# EAGLE design Power PCB_v4 (EAGLE 9.7.0)
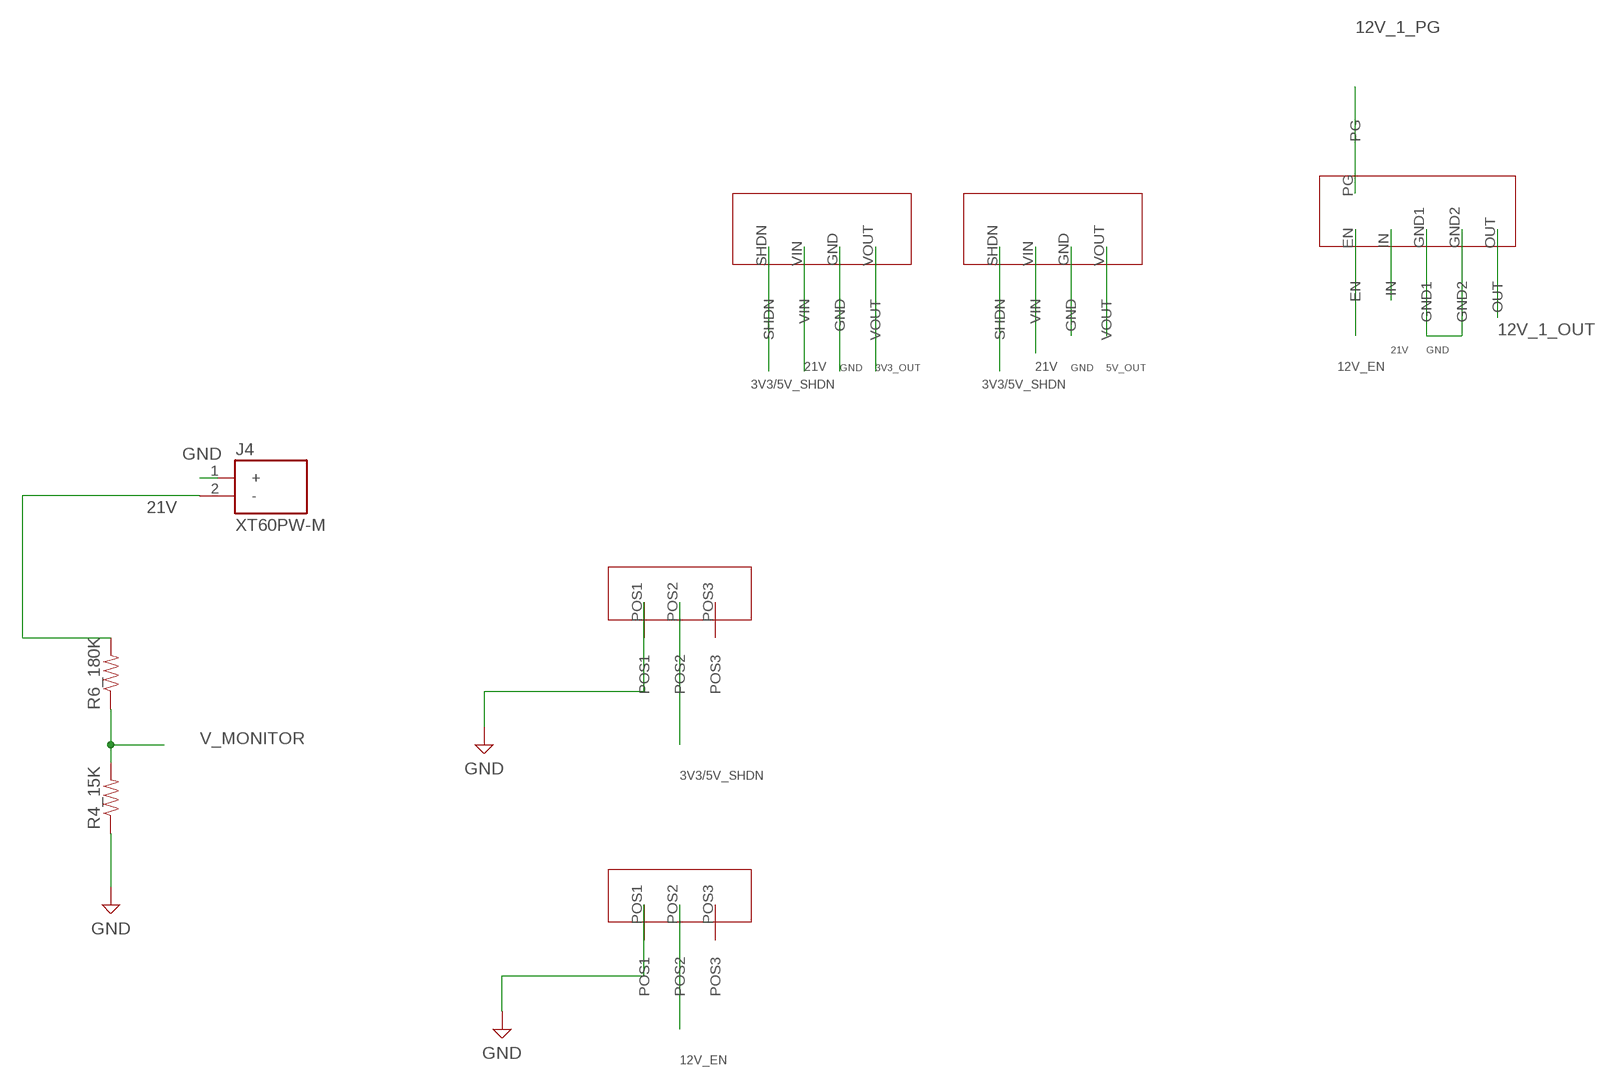
[diagram p0: schematic, sheet 1, part 1 of 2]
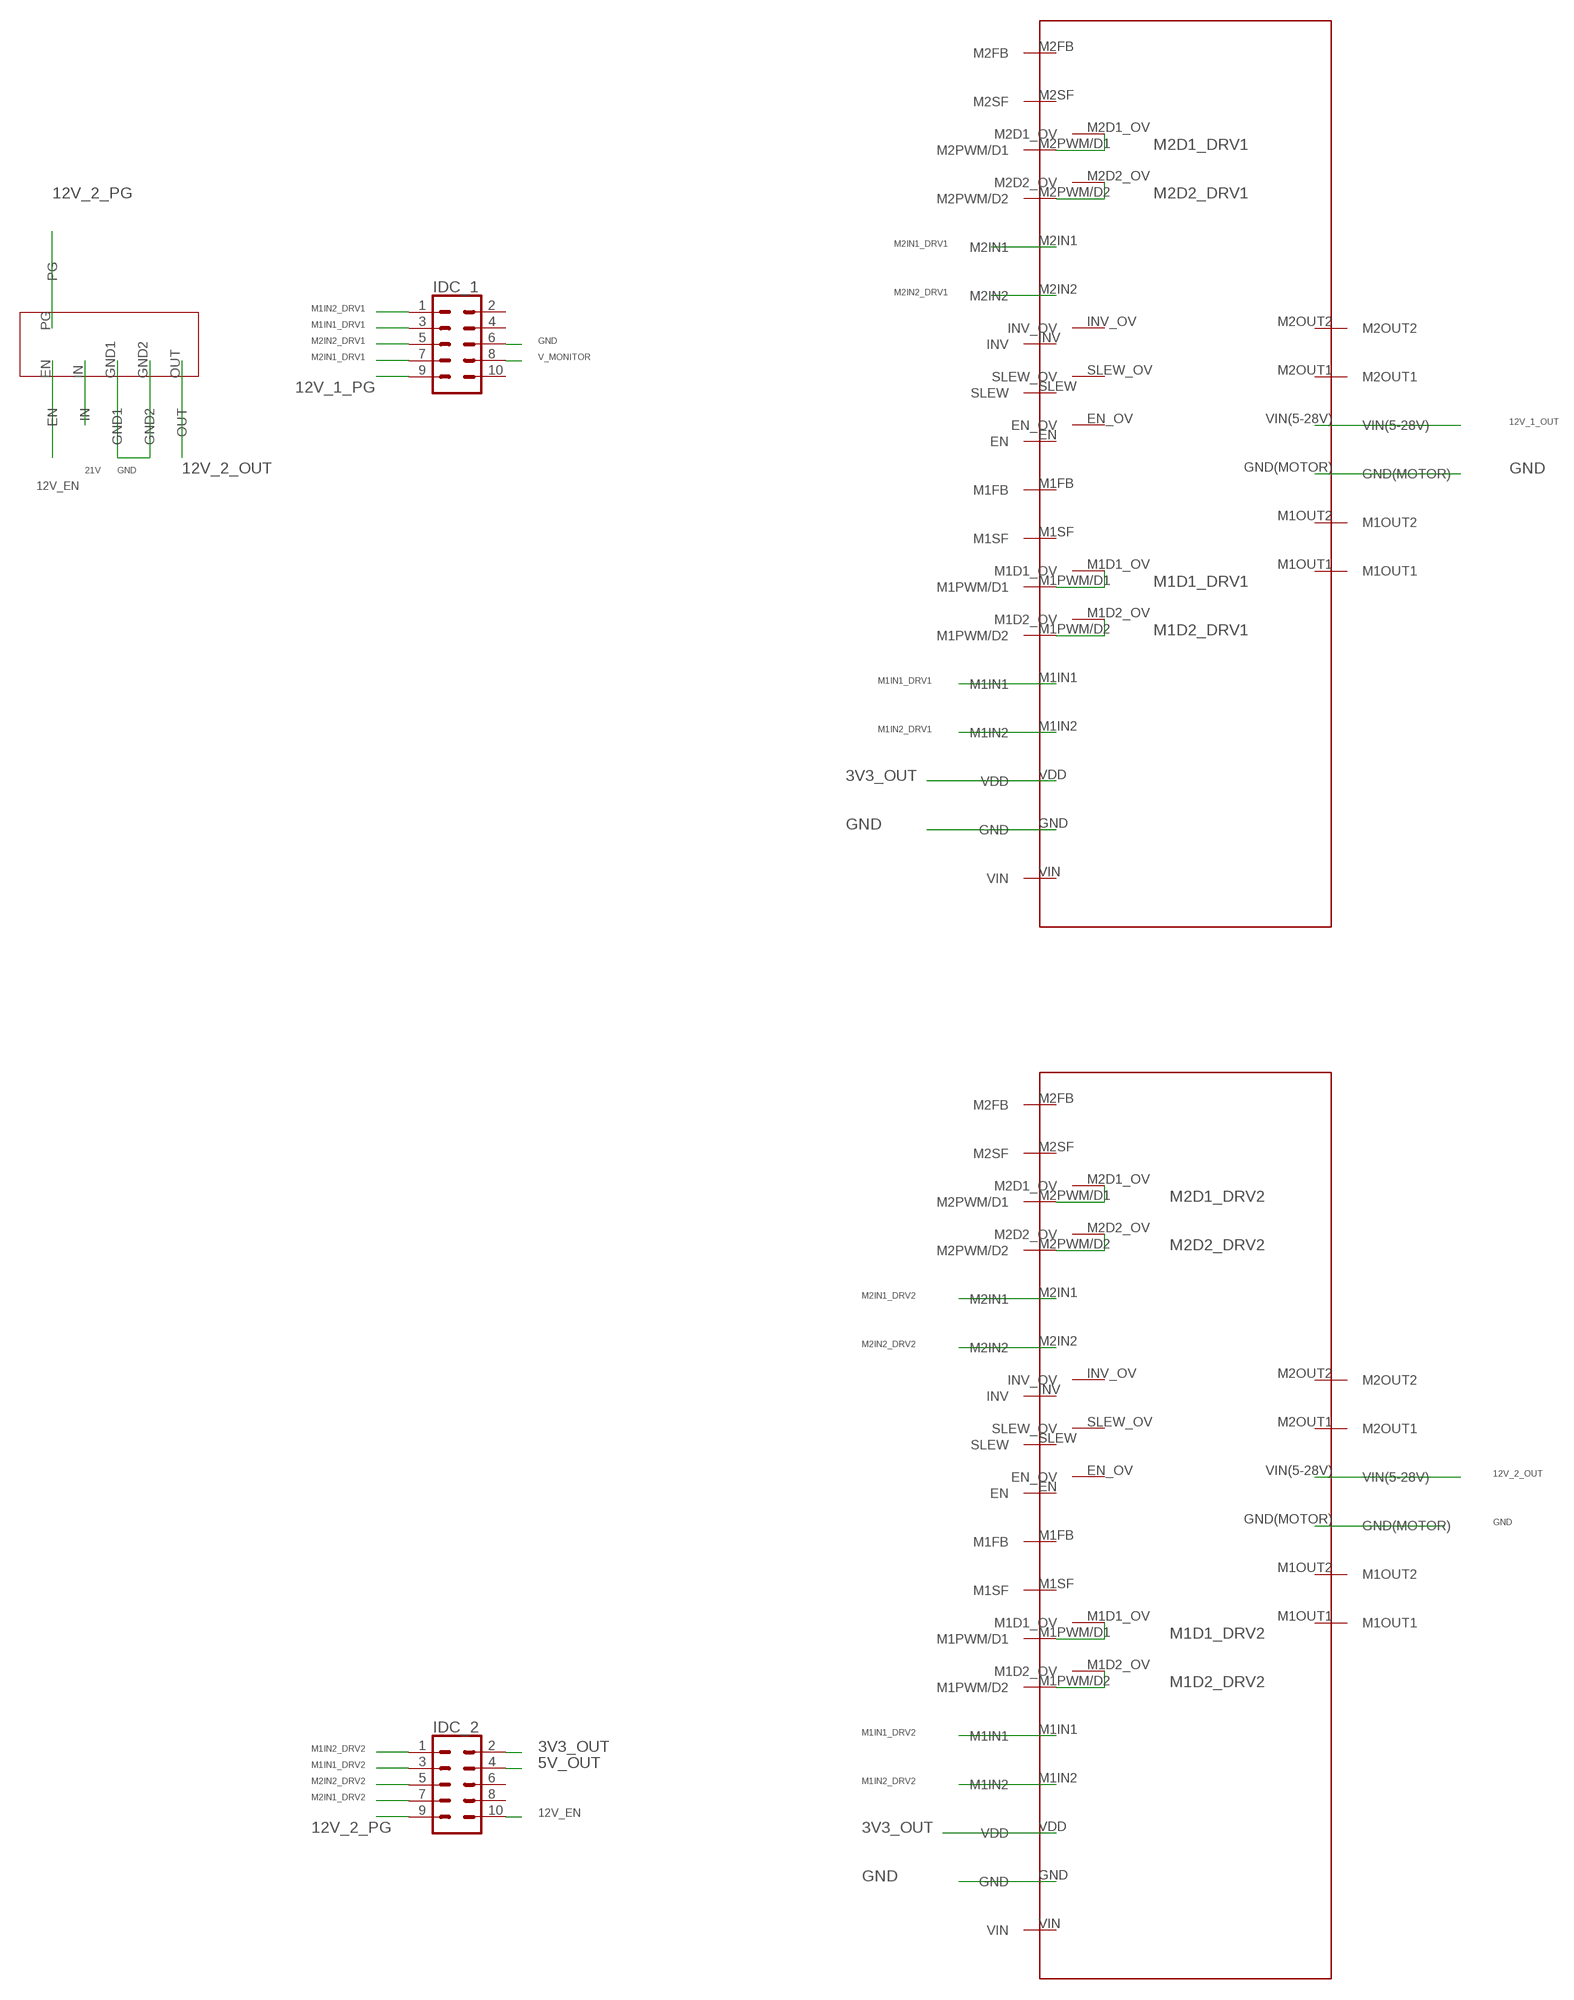
[diagram p1: schematic, sheet 1, part 2 of 2]

## Parts
IDC_1  CONN_05X2PTH  [2X5]
IDC_2  CONN_05X2PTH  [2X5]
J4  XT60PW-M  [AMASS_XT60PW-M]
R4_15K  RESISTORAXIAL-0.3  [AXIAL-0.3]
R6_180K  RESISTORAXIAL-0.3  [AXIAL-0.3]
U$1  CUSTOM_MOTORDRIVER  [CUSTOM_MOTORDRIVER]
U$2  CUSTOM_12V_REG  [CUSTOM_12V_REG]
U$3  CUSTOM_12V_REG  [CUSTOM_12V_REG]
U$4  CUSTOM_3.3/5V_REG  [CUSTOM_3.3/5V_REG]
U$5  CUSTOM_3.3/5V_REG  [CUSTOM_3.3/5V_REG]
U$6  CUSTOM_MOTORDRIVER  [CUSTOM_MOTORDRIVER]
U$7  CUSTOM_SWITCH  [CUSTOM_SWITCH]
U$8  CUSTOM_SWITCH  [CUSTOM_SWITCH]

## Nets
3V3/5V_SHDN: U$4.SHDN U$5.SHDN U$7.POS2
3V3_OUT: IDC_2.2 U$1.VDD U$4.VOUT U$6.VDD
5V_OUT: IDC_2.4 U$5.VOUT
12V_1_OUT: U$1.VIN(5-28V) U$3.OUT
12V_1_PG: IDC_1.9 U$3.PG
12V_2_OUT: U$2.OUT U$6.VIN(5-28V)
12V_2_PG: IDC_2.9 U$2.PG
12V_EN: IDC_2.10 U$2.EN U$3.EN U$8.POS2
21V: J4.2(-) R6_180K.P$2 U$2.IN U$3.IN U$4.VIN U$5.VIN
GND: IDC_1.6 J4.1(+) R4_15K.P$1 U$1.GND U$1.GND(MOTOR) U$2.GND1 U$2.GND2 U$3.GND1 U$3.GND2 U$4.GND U$5.GND U$6.GND U$6.GND(MOTOR) U$7.POS1 U$8.POS1
M1D1_DRV1: U$1.M1D1_OV U$1.M1PWM/D1
M1D1_DRV2: U$6.M1D1_OV U$6.M1PWM/D1
M1D2_DRV1: U$1.M1D2_OV U$1.M1PWM/D2
M1D2_DRV2: U$6.M1D2_OV U$6.M1PWM/D2
M1IN1_DRV1: IDC_1.3 U$1.M1IN1
M1IN1_DRV2: IDC_2.3 U$6.M1IN1
M1IN2_DRV1: IDC_1.1 U$1.M1IN2
M1IN2_DRV2: IDC_2.1 U$6.M1IN2
M2D1_DRV1: U$1.M2D1_OV U$1.M2PWM/D1
M2D1_DRV2: U$6.M2D1_OV U$6.M2PWM/D1
M2D2_DRV1: U$1.M2D2_OV U$1.M2PWM/D2
M2D2_DRV2: U$6.M2D2_OV U$6.M2PWM/D2
M2IN1_DRV1: IDC_1.7 U$1.M2IN1
M2IN1_DRV2: IDC_2.7 U$6.M2IN1
M2IN2_DRV1: IDC_1.5 U$1.M2IN2
M2IN2_DRV2: IDC_2.5 U$6.M2IN2
V_MONITOR: IDC_1.8 R4_15K.P$2 R6_180K.P$1
Unconnected: IDC_1.2 IDC_1.4 IDC_1.10 IDC_2.6 IDC_2.8 U$1.EN U$1.EN_OV U$1.INV U$1.INV_OV U$1.M1FB U$1.M1OUT1 U$1.M1OUT2 U$1.M1SF U$1.M2FB U$1.M2OUT1 U$1.M2OUT2 U$1.M2SF U$1.SLEW U$1.SLEW_OV U$1.VIN U$6.EN U$6.EN_OV U$6.INV U$6.INV_OV U$6.M1FB U$6.M1OUT1 U$6.M1OUT2 U$6.M1SF U$6.M2FB U$6.M2OUT1 U$6.M2OUT2 U$6.M2SF U$6.SLEW U$6.SLEW_OV U$6.VIN U$7.POS3 U$8.POS3

## Library data of the parts
IDC_1 IDC_2 = SparkFun-Connectors:CONN_05X2: Multi connection point. Often used as Generic Header-pin footprint for 0.1 inch spaced/style header connections For AVR SPI programming port, see special device with nice symbol: "AVR_SPI_PROG_5x2.dev" You can populate with any combo of single row headers, but if you'd like an exact match, check these: 2x5 AVR ICSP Male Header <https://www.sparkfun.com/products/778> (PRT-00778) 2x5 Pin Shrouded Header <https://www.sparkfun.com/products/8506> (PRT-08506) On any of the 0.1 inch spaced packages, you can populate with these: Break Away Headers - Straight <https://www.sparkfun.com/products/116> (PRT-00116) Break Away Male Headers - Right Angle <https://www.sparkfun.com/products/553> (PRT-00553) Female Headers <https://www.sparkfun.com/products/115> (PRT-00115) Break Away Headers - Machine Pin <https://www.sparkfun.com/products/117> (PRT-00117) Break Away Female Headers - Swiss Machine Pin <https://www.sparkfun.com/products/743> (PRT-00743) Special note: the shrouded connector mates well with our 5x2 ribbon cables: 2x5 Pin IDC Ribbon Cable <https://www.sparkfun.com/products/8535> (PRT-08535); PROD_ID: CONN-08499; SF_ID: PRT-0778
J4 = XT60PW-M:XT60PW-M: Check availability <https://pricing.snapeda.com/parts/XT60PW-M/AMASS/view-part?ref=eda>; AVAILABILITY: Not in stock; CHECK_PRICES: https://www.snapeda.com/parts/XT60PW-M/AMASS/view-part/?ref=eda; DESCRIPTION: Socket, DC supply, male, PIN: 2; MF: AMASS; MP: XT60PW-M; PACKAGE: Package; PRICE: None; SNAPEDA_LINK: https://www.snapeda.com/parts/XT60PW-M/AMASS/view-part/?ref=snap
R4_15K R6_180K = SparkFun-Resistors:RESISTOR: Generic Resistor Package
U$1 U$6 = Custom_MotorDriver:CUSTOM_MOTORDRIVER
U$2 U$3 = Footprint Complete:CUSTOM_12V_REG
U$4 U$5 = Custom_3.3/5V_Reg:CUSTOM_3.3/5V_REG
U$7 U$8 = Custom_Switch:CUSTOM_SWITCH

## Board
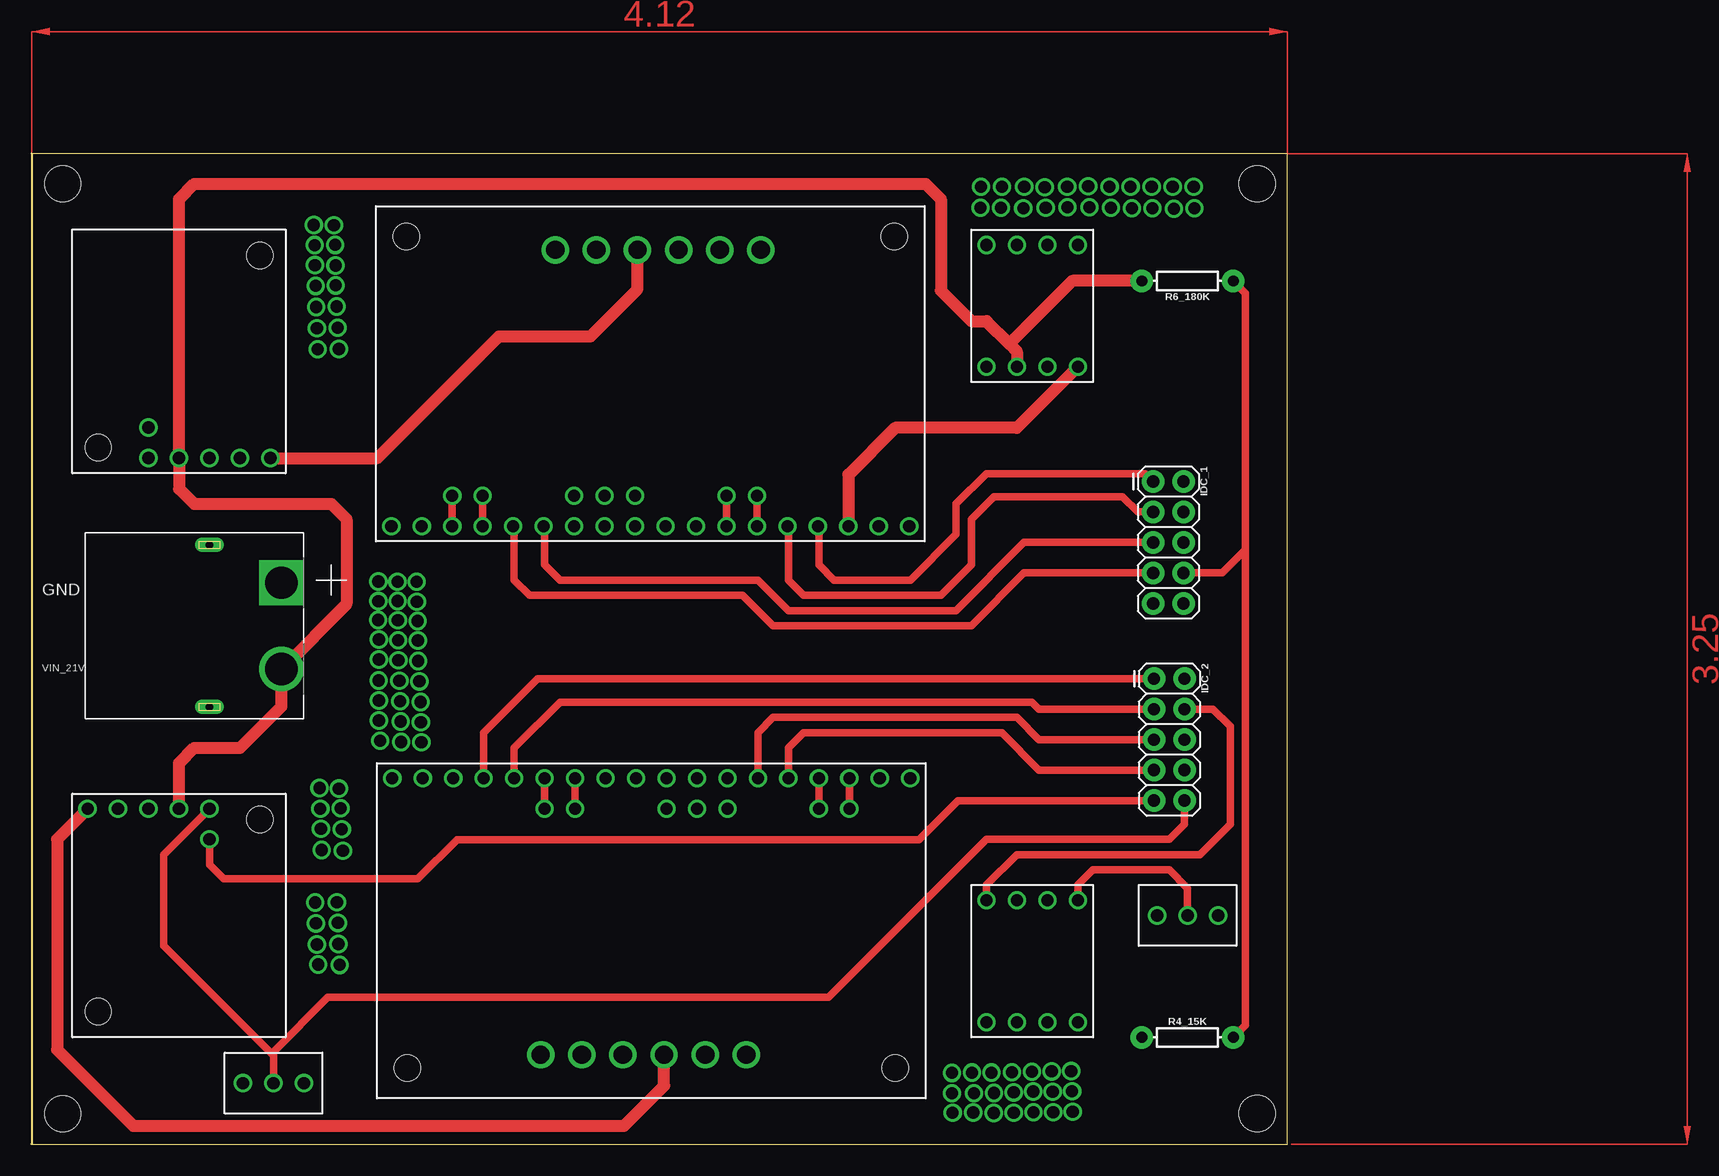
[diagram p2: board, top side]
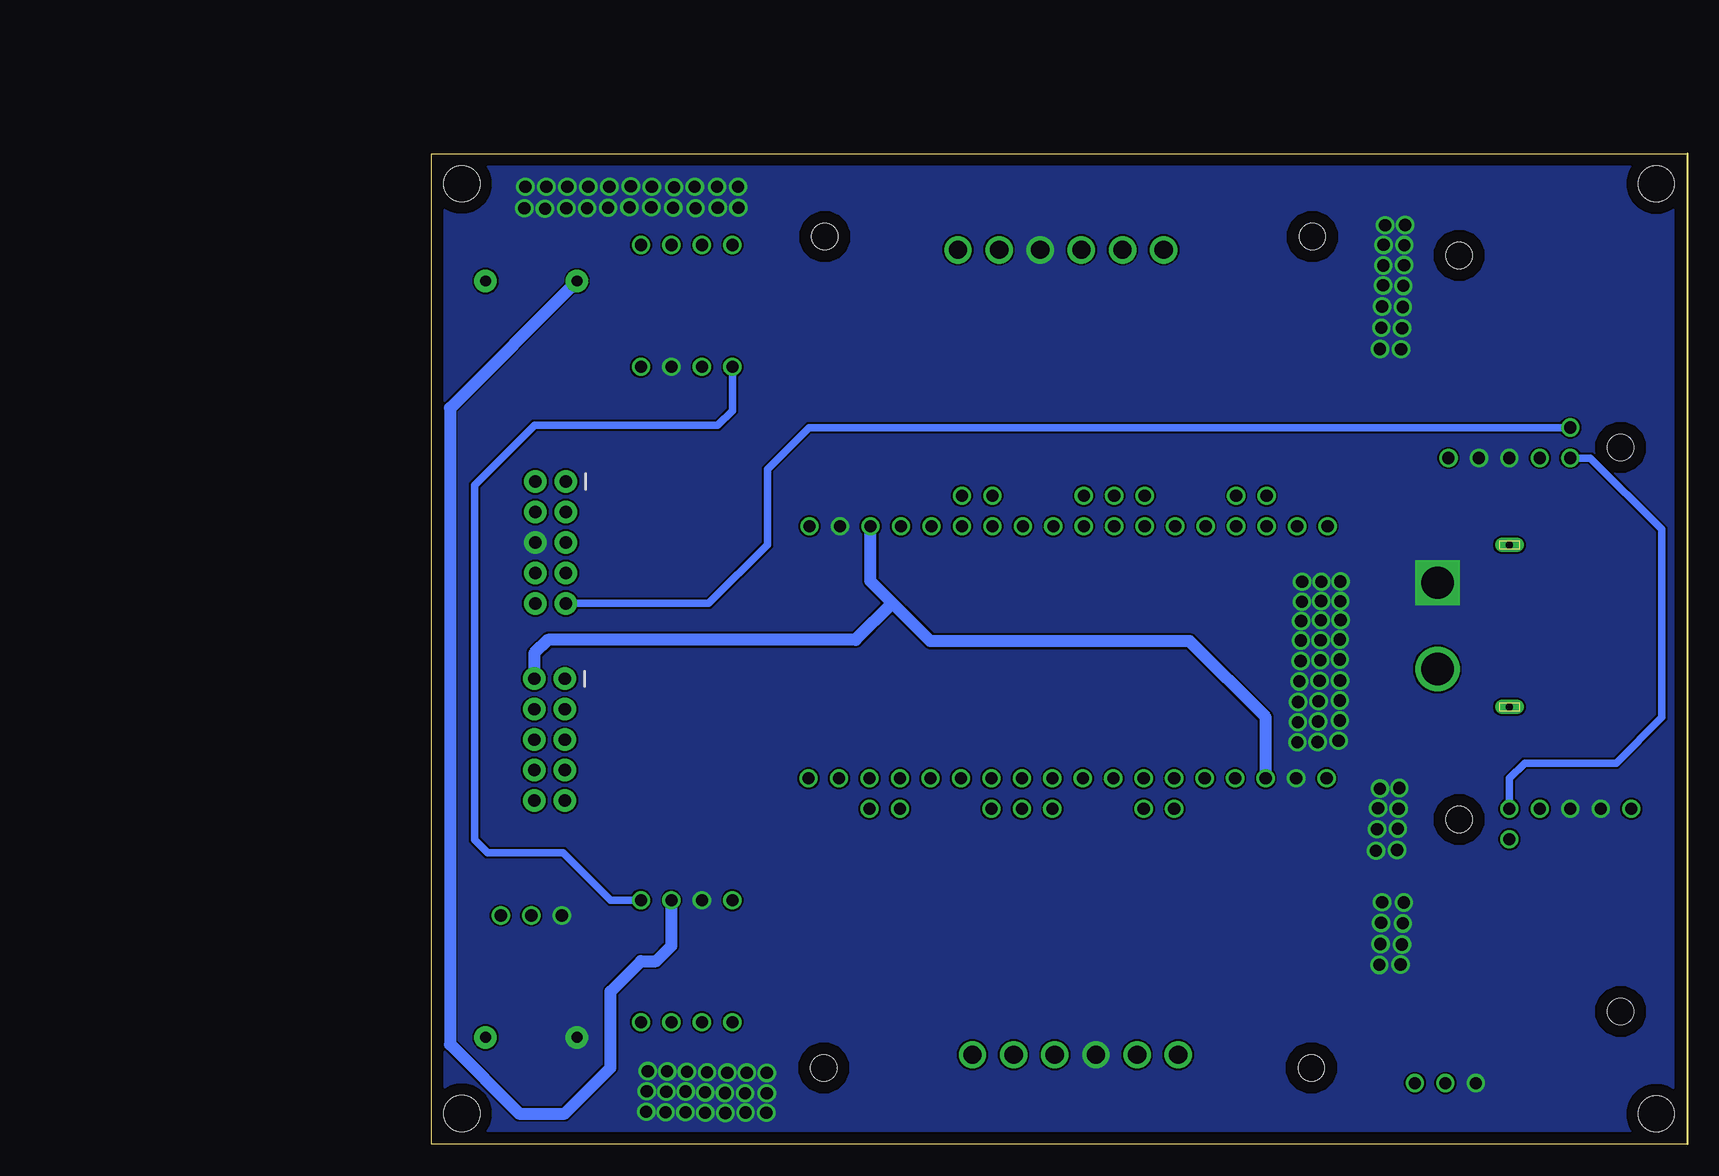
[diagram p3: board, bottom side, seen from below]

Size 104.67 x 82.54 mm. Coordinates in mm from the lower left corner, seen from the top.
Outline: 0,0 104.67,0 104.67,82.54 0,82.54 0,0
Copper layers (1*16): Top / Bottom
Stack-up Default Layer Stack: Top User Defined 0.035mm / Dielectric-1 User Defined 1.5mm / Bottom User Defined 0.035mm
Design rules: minimum copper width 6mil, minimum drill size 0.35mm, copper clearance wire_polygon to wire_polygon 6mil, copper clearance wire_polygon to pad_smd 6mil, copper clearance wire_polygon to via 6mil, copper clearance pad_smd to pad_smd 6mil, copper clearance pad_smd to via 6mil, copper clearance via to via 6mil, copper clearance smd to pad (same net) 6mil, copper clearance smd to via (same net) 6mil, copper clearance smd to smd (same net) 6mil, dimension clearance 40mil, via restrict clearance 0mil, restrict clearance 0mil, drill distance 6mil, keepout clearance 0mil
Holes 3 mm at 102.15,80.02 2.59,80.02 2.59,2.52 102.15,2.55

### Footprints (pad centres in the part's own frame; a part is rotated, then mirrored left to right if it is on the bottom)
2X5 = drill 1.016 pad 1.88: 1 0,0; 2 0,2.54; 3 2.54,0; 4 2.54,2.54; 5 5.08,0; 6 5.08,2.54; 7 7.62,0; 8 7.62,2.54; 9 10.16,0; 10 10.16,2.54
AMASS_XT60PW-M = drill 2.7 square: 1 3.6,-6 | drill 2.7: 2 -3.6,-6 | drill 0.6 pad 1.2 long: S1 6.75,0; S2 -6.75,0
AXIAL-0.3 = drill 0.9 pad 1.88: P$1 -3.81,0; P$2 3.81,0
CUSTOM_MOTORDRIVER = drill 1.016: EN 21.59,1.27; EN_OV 21.59,3.81; GND 41.91,1.27; INV 16.51,1.27; INV_OV 16.51,3.81; M1D1_OV 29.21,3.81; M1D2_OV 31.75,3.81; M1FB 24.13,1.27; M1IN1 34.29,1.27; M1IN2 36.83,1.27; M1PWM/D1 29.21,1.27; M1PWM/D2 31.75,1.27; M1SF 26.67,1.27; M2D1_OV 6.35,3.81; M2D2_OV 8.89,3.81; M2FB 1.27,1.27; M2IN1 11.43,1.27; M2IN2 13.97,1.27; M2PWM/D1 6.35,1.27; M2PWM/D2 8.89,1.27; M2SF 3.81,1.27; SLEW 19.05,1.27; SLEW_OV 19.05,3.81; VDD 39.37,1.27; VIN 44.45,1.27 | drill 1.524: GND(MOTOR) 25.222,24.308; M1OUT1 32.08,24.308; M1OUT2 28.651,24.308; M2OUT1 18.364,24.308; M2OUT2 14.935,24.308; VIN(5-28V) 21.793,24.308 | hole 2.184: 2.54,25.4; 43.18,25.4
CUSTOM_12V_REG = drill 1.016: EN 6.35,1.27; GND1 11.43,1.27; GND2 13.97,1.27; IN 8.89,1.27; OUT 16.51,1.27; PG 6.35,3.81 | hole 2.184: 2.159,2.159; 15.621,18.161
CUSTOM_3.3/5V_REG = drill 1.016: GND 6.35,1.27; SHDN 1.27,1.27; STND_1 1.27,11.43; STND_2 3.81,11.43; STND_3 6.35,11.43; STND_4 8.89,11.43; VIN 3.81,1.27; VOUT 8.89,1.27
CUSTOM_SWITCH = drill 1.016: POS1 1.524,2.54; POS2 4.064,2.54; POS3 6.604,2.54

### Placement (x,y rotation side)
IDC_1  93.49,55.21 270 top
IDC_2  93.57,38.79 270 top
J4  14.83,43.18 90 top
R4_15K  96.36,8.89 0 top
R6_180K  96.36,71.93 180 top
U$1  28.72,50.22 0 top
U$2  21.18,29.21 180 top
U$3  3.4,55.9 0 top
U$4  78.33,63.5 0 top
U$5  88.49,21.59 180 top
U$6  74.52,31.75 180 top
U$7  92.3,16.51 0 top
U$8  16.1,2.54 0 top

### Tracks (layer width: path | path; a pad name or v marks a point on that pad's centre or on a via)
3V3/5V_SHDN
  Top 0.61: U$7.POS2 96.36,21.34 94.84,22.86 88.49,22.86 87.22,21.59 U$5.SHDN
  Bottom 0.61: U$5.SHDN 89.74,20.32 93.71,24.29 100.02,24.29 101.09,25.36 101.09,54.9 96.09,59.9 80.82,59.9 79.6,61.12 U$4.SHDN
3V3_OUT
  Top 1.016: U$4.VOUT 82.14,59.69 71.98,59.69 68.09,55.8 U$1.VDD
  Bottom 1.016: U$6.VDD 35.15,35.56 41.5,41.91 63.09,41.91 66.27,45.09 | 66.27,45.09 68.09,46.91 U$1.VDD | 66.27,45.09 69.33,42.02 94.97,42.02 96.11,40.88 IDC_2.2
5V_OUT
  Top 0.61: U$5.VOUT 79.6,21.59 82.14,24.13 97.38,24.13 99.92,26.67 99.92,34.8 98.48,36.25 IDC_2.4
12V_1_OUT
  Top 1.016: U$3.OUT 28.82,57.17 38.96,67.31 46.58,67.31 50.51,71.24 U$1.VIN(5-28V)
12V_1_PG
  Bottom 0.61: U$3.PG 73.2,59.71 76.69,56.23 76.69,49.94 81.57,45.05 IDC_1.9
12V_2_OUT
  Top 1.016: U$2.OUT 2.13,25.4 2.13,7.87 8.48,1.52 49.37,1.52 52.73,4.88 U$6.VIN(5-28V)
12V_2_PG
  Top 0.61: U$2.PG 14.83,23.3 16.03,22.09 32.2,22.09 35.47,25.37 73.98,25.37 77.24,28.63 IDC_2.9
12V_EN
  Top 0.61: U$2.EN 11.02,24.13 11.02,16.51 20.16,7.37 U$8.POS2 20.16,7.7 24.7,12.23 66.44,12.23 79.6,25.4 94.84,25.4 96.11,26.67 IDC_2.10
  Bottom 0.61: U$2.EN 14.83,30.48 13.56,31.75 5.94,31.75 2.13,35.56 2.13,51.22 8.08,57.17 U$3.EN
21V
  Top 1.016: U$2.IN 12.29,31.75 13.56,33.02 17.37,33.02 20.83,36.48 J4.2 26.26,45.01 26.26,52.07 24.99,53.34 13.56,53.34 12.29,54.61 U$3.IN 12.29,78.74 13.56,80.01 74.52,80.01 75.79,78.74 75.79,71.12 78.33,68.58 79.6,68.58 81.51,66.67 | 81.51,66.67 82.14,66.04 U$4.VIN | R6_180K.P$2 86.76,71.93 81.51,66.67
  Bottom 1.016: R6_180K.P$2 103.15,61.34 103.15,8.31 97.38,2.54 93.57,2.54 89.76,6.35 89.76,12.7 87.22,15.24 85.95,15.24 84.68,16.51 U$5.VIN
GND  (via drill 1.02)
  other vias: 28.91,45.25 30.52,45.26 28.9,43.68 30.54,43.66 32.19,43.59 32.13,45.2 28.96,42.05 30.56,41.99 32.21,41.97 28.96,40.38 30.58,40.32 32.23,40.26 28.93,38.63 30.66,38.6 32.33,38.56 28.91,46.89 30.5,46.86 32.1,46.86 28.95,36.97 30.73,36.91 32.44,36.85 28.95,35.3 30.77,35.22 32.46,35.16 29.06,33.61 30.81,33.51 32.5,33.49 23.53,76.58 25.2,76.56 23.59,74.92 23.61,73.25 23.68,71.52 23.72,69.76 23.78,67.99 23.85,66.24 25.32,74.94 25.34,73.21 25.35,71.56 25.44,69.8 25.51,68.03 25.62,66.26 24.01,29.68 25.62,29.62 24.07,27.95 25.77,27.98 24.13,26.27 25.86,26.24 24.19,24.51 25.95,24.45 23.63,20.13 25.45,20.16 23.71,18.39 25.53,18.43 23.78,16.63 25.58,16.68 23.9,14.96 25.68,14.93 79.13,79.78 80.88,79.78 79.1,78.03 80.81,78.03 82.67,77.99 84.53,78.03 86.36,78.06 88.18,78.06 89.97,78.03 91.72,77.99 93.44,77.99 95.22,77.95 96.94,77.99 96.87,79.78 95.11,79.78 93.36,79.78 91.61,79.78 89.86,79.78 88.07,79.81 86.32,79.78 84.46,79.74 82.75,79.78 76.73,5.93 78.4,5.96 80.02,5.96 81.72,5.98 83.39,6.03 85.04,6.06 86.66,6.08 76.73,4.23 78.55,4.23 80.22,4.26 81.87,4.31 83.49,4.38 85.11,4.36 86.73,4.41 76.78,2.61 78.5,2.64 80.2,2.58 81.87,2.61 83.52,2.66 85.16,2.66 86.78,2.69
  pour Bottom (no thermals): -1.68,85.09 106.27,85.09 106.27,-2.54 -1.68,-2.54
M1D1_DRV1
  Top 0.61: U$1.M1D1_OV U$1.M1PWM/D1
M1D1_DRV2
  Top 0.61: U$6.M1PWM/D1 U$6.M1D1_OV
M1D2_DRV1
  Top 0.61: U$1.M1D2_OV U$1.M1PWM/D2
M1D2_DRV2
  Top 0.61: U$6.M1PWM/D2 U$6.M1D2_OV
M1IN1_DRV1
  Top 0.61: U$1.M1IN1 63.09,51.4 63.09,46.99 64.36,45.72 75.79,45.72 78.33,48.26 78.33,52.07 80.2,53.94 90.95,53.94 92.22,52.67 IDC_1.3
M1IN1_DRV2
  Top 0.61: U$6.M1IN1 40.23,33.02 44.04,36.83 83.41,36.83 83.99,36.25 IDC_2.3
M1IN2_DRV1
  Top 0.61: U$1.M1IN2 65.63,51.4 65.63,48.26 66.9,46.99 73.25,46.99 77.06,50.8 77.06,53.34 79.6,55.88 92.82,55.88 IDC_1.1
M1IN2_DRV2
  Top 0.61: IDC_2.1 42.19,38.79 37.69,34.29 U$6.M1IN2
M2D1_DRV1
  Top 0.61: U$1.M2D1_OV U$1.M2PWM/D1
M2D1_DRV2
  Top 0.61: U$6.M2PWM/D1 U$6.M2D1_OV
M2D2_DRV1
  Top 0.61: U$1.M2D2_OV U$1.M2PWM/D2
M2D2_DRV2
  Top 0.61: U$6.M2PWM/D2 U$6.M2D2_OV
M2IN1_DRV1
  Top 0.61: U$1.M2IN1 40.23,51.4 40.23,46.99 41.5,45.72 59.28,45.72 61.82,43.18 78.33,43.18 82.74,47.59 IDC_1.7
M2IN1_DRV2
  Top 0.61: U$6.M2IN1 63.09,33.02 64.36,34.29 80.87,34.29 83.99,31.17 IDC_2.7
M2IN2_DRV1
  Top 0.61: U$1.M2IN2 42.77,51.4 42.77,48.26 44.04,46.99 60.55,46.99 63.09,44.45 77.06,44.45 82.74,50.13 IDC_1.5
M2IN2_DRV2
  Top 0.61: U$6.M2IN2 60.55,34.29 61.82,35.56 82.14,35.56 83.99,33.71 IDC_2.5
V_MONITOR
  Top 0.61: R6_180K.P$1 101.19,70.92 101.19,49.53 | 101.19,49.53 99.25,47.59 IDC_1.8 | 101.19,49.53 101.19,9.91 R4_15K.P$2
(copper drawn outside any net)
  shapes: Top area x2

### Text on the board
tPlace: GND | VIN_21V